# EAGLE design Arduino Talking RepeaterV2.1 (EAGLE 7.4.0)

## Sheet 1 of 2: MAIN Circuit Diagram
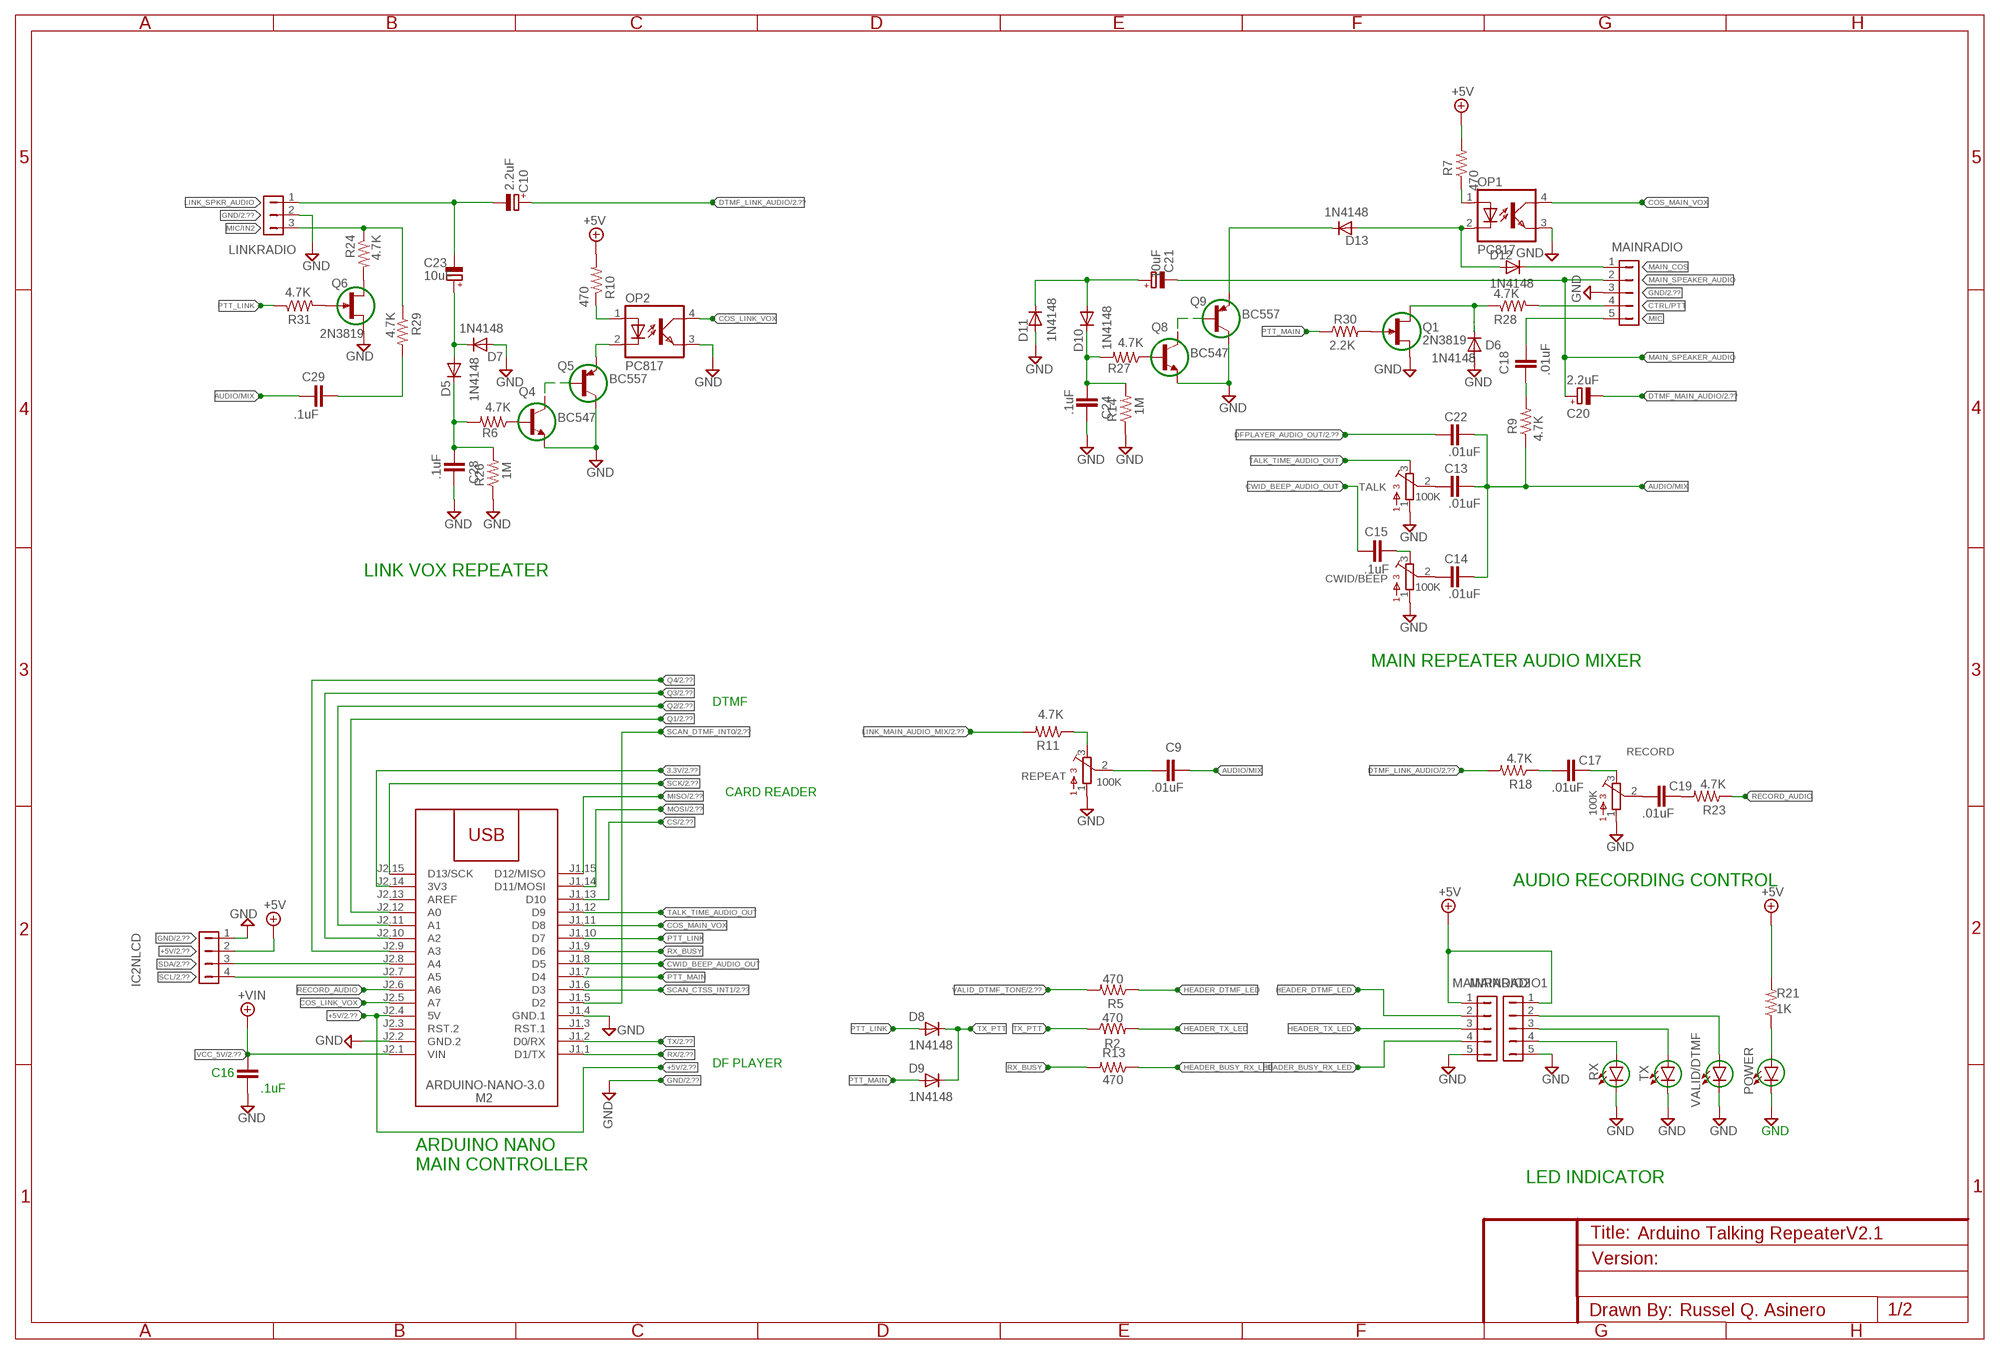
[diagram p0: schematic, sheet 1]

### Parts
C9  .01uF  C5/3  [C5B3]
C10  2.2uF  CPOL-EUE2.5-6  [E2,5-6]
C13  .01uF  C5/3  [C5B3]
C14  .01uF  C5/3  [C5B3]
C15  .1uF  C5/3  [C5B3]
C16  .1uF  C5/3  [C5B3]
C17  .01uF  C5/3  [C5B3]
C18  .01uF  C5/3  [C5B3]
C19  .01uF  C5/3  [C5B3]
C20  2.2uF  CPOL-EUE2.5-6  [E2,5-6]
C21  10uF  CPOL-EUE2.5-6  [E2,5-6]
C22  .01uF  C5/3  [C5B3]
C23  10uF  CPOL-EUE2.5-6  [E2,5-6]
C24  .1uF  C5/3  [C5B3]
C28  .1uF  C5/3  [C5B3]
C29  .1uF  C5/3  [C5B3]
CWID/BEEP  100K  3362P  [3362P]
D5  1N4148  1N4148DO35-10  [DO35-10]
D6  1N4148  1N4148DO35-10  [DO35-10]
D7  1N4148  1N4148DO35-10  [DO35-10]
D8  1N4148  1N4148DO35-10  [DO35-10]
D9  1N4148  1N4148DO35-10  [DO35-10]
D10  1N4148  1N4148DO35-10  [DO35-10]
D11  1N4148  1N4148DO35-10  [DO35-10]
D12  1N4148  1N4148DO35-10  [DO35-10]
D13  1N4148  1N4148DO35-10  [DO35-10]
IC2NLCD  HDR-1X4-70543-?  [70543-04]
LINKRADIO  HDR-1X3-70543-?  [70543-03]
M2  ARDUINO-NANO-3.0  [ARDUINO-NANO-3.0]
MAINRADIO  HDR-1X5-70543-?  [70543-05]
MAINRADIO1  HDR-1X5-70543-?  [70543-05]
MAINRADIO2  HDR-1X5-70543-?  [70543-05]
OP1  PC817  [DIL04]
OP2  PC817  [DIL04]
POWER  LEDB155  [Q62902-B155]
Q1  2N3819  [TO92F]
Q4  BC547  [TO92]
Q5  BC557  [TO92]
Q6  2N3819  [TO92F]
Q8  BC547  [TO92]
Q9  BC557  [TO92]
R2  470  R-US_0207/10  [0207/10]
R5  470  R-US_0207/10  [0207/10]
R6  4.7K  R-US_0207/10  [0207/10]
R7  470  R-US_0207/10  [0207/10]
R9  4.7K  R-US_0207/10  [0207/10]
R10  470  R-US_0207/10  [0207/10]
R11  4.7K  R-US_0207/10  [0207/10]
R13  470  R-US_0207/10  [0207/10]
R14  1M  R-US_0207/10  [0207/10]
R18  4.7K  R-US_0207/10  [0207/10]
R21  1K  R-US_0207/10  [0207/10]
R23  4.7K  R-US_0207/10  [0207/10]
R24  4.7K  R-US_0207/10  [0207/10]
R26  1M  R-US_0207/10  [0207/10]
R27  4.7K  R-US_0207/10  [0207/10]
R28  4.7K  R-US_0207/10  [0207/10]
R29  4.7K  R-US_0207/10  [0207/10]
R30  2.2K  R-US_0207/10  [0207/10]
R31  4.7K  R-US_0207/10  [0207/10]
RECORD  100K  3362P  [3362P]
REPEAT  100K  3362P  [3362P]
RX  LEDB155  [Q62902-B155]
TALK  100K  3362P  [3362P]
TX  LEDB155  [Q62902-B155]
VALID/DTMF  LEDB155  [Q62902-B155]

### Nets
3.3V: M2.J2.14(3V3) ; also sheet 2
+5V: IC2NLCD.2 M2.J2.4(5V) R7.2 R10.2 ; also sheet 2
AUDIO/MIX: C9.1 C13.1 C14.1 C22.1 C29.1 R9.1
BUSY_RX_LED: MAINRADIO2.4 RX.A(ANODE)
COR: D12.A D13.A OP1.2(C)
COR1: OP2.2(C) Q5.1(E)
COS_LINK_VOX: M2.J2.5(A7) OP2.4(COL)
COS_MAIN_VOX: M2.J1.11(D8) OP1.4(COL)
CS: M2.J1.13(D10) ; also sheet 2
CTRL/PTT: MAINRADIO.4 R28.2
CWID_BEEP_AUDIO_OUT: C15.1 M2.J1.8(D5)
DFPLAYER_AUDIO_OUT: C22.2 ; also sheet 2
DTMF_LED: MAINRADIO2.2 VALID/DTMF.A(ANODE)
DTMF_LINK_AUDIO: C10.+ R18.2 ; also sheet 2
DTMF_MAIN_AUDIO: C20.- ; also sheet 2
GND: C16.2 C24.1 C28.1 CWID/BEEP.1 D6.A D7.A D11.A IC2NLCD.1 LINKRADIO.2 M2.J1.4(GND.1) M2.J2.2(GND.2) MAINRADIO1.5 MAINRADIO2.5 MAINRADIO.3 OP1.3(EMIT) OP2.3(EMIT) POWER.K(CATHODE) Q1.S Q4.1(E) Q5.3(C) Q6.S Q8.1(E) Q9.3(C) R14.1 R26.1 RECORD.1 REPEAT.1 RX.K(CATHODE) TALK.1 TX.K(CATHODE) VALID/DTMF.K(CATHODE) ; also sheet 2
HEADER_BUSY_RX_LED: MAINRADIO1.4 R13.1
HEADER_DTMF_LED: MAINRADIO1.2 R5.1
HEADER_TX_LED: MAINRADIO1.3 R2.2
LINK_MAIN_AUDIO_MIX: R11.2 ; also sheet 2
LINK_SPKR_AUDIO: C10.- C23.- LINKRADIO.1
MAIN_COS: D12.C MAINRADIO.1
MAIN_SPEAKER_AUDIO: C20.+ C21.- MAINRADIO.2
MIC: C18.1 MAINRADIO.5
MIC/IN2: LINKRADIO.3 R24.1 R29.1
MISO: M2.J1.15(D12/MISO) ; also sheet 2
MOSI: M2.J1.14(D11/MOSI) ; also sheet 2
N$1: OP2.1(A) R10.1
N$6: Q4.2(B) R6.1
N$9: C15.2 CWID/BEEP.3
N$13: C18.2 R9.2
N$17: C29.2 R29.2
N$18: OP1.1(A) R7.1
N$25: C14.2 CWID/BEEP.2
N$26: R11.1 REPEAT.3
N$27: C9.2 REPEAT.2
N$29: C19.2 RECORD.2
N$30: C17.1 RECORD.3
N$34: C19.1 R23.2
N$38: POWER.A(ANODE) R21.1
N$46: Q8.3(C) Q9.2(B)
N$47: C13.2 TALK.2
N$48: C21.+ D10.A D11.C
N$50: C24.2 D10.C R14.2 R27.2
N$51: Q8.2(B) R27.1
N$54: C17.2 R18.1
N$55: D13.C Q9.1(E)
N$70: Q4.3(C) Q5.2(B)
N$72: Q6.D R24.2
N$73: Q1.G R30.2
N$77: C23.+ D5.A D7.C
N$78: C28.2 D5.C R6.2 R26.2
NA: D6.C Q1.D R28.1
PTT: Q6.G R31.2
PTT_LINK: D8.A M2.J1.10(D7) R31.1
PTT_MAIN: D9.A M2.J1.7(D4) R30.1
Q1: M2.J2.12(A0) ; also sheet 2
Q2: M2.J2.11(A1) ; also sheet 2
Q3: M2.J2.10(A2) ; also sheet 2
Q4: M2.J2.9(A3) ; also sheet 2
RECORD_AUDIO: M2.J2.6(A6) R23.1
RX: M2.J1.1(D1/TX) ; also sheet 2
RX_BUSY: M2.J1.9(D6) R13.2
SCAN_CTSS_INT1: M2.J1.6(D3) ; also sheet 2
SCAN_DTMF_INT0: M2.J1.5(D2) ; also sheet 2
SCK: M2.J2.15(D13/SCK) ; also sheet 2
SCL: IC2NLCD.4 M2.J2.7(A5) ; also sheet 2
SDA: IC2NLCD.3 M2.J2.8(A4) ; also sheet 2
TALK_TIME_AUDIO_OUT: M2.J1.12(D9) TALK.3
TX: M2.J1.2(D0/RX) ; also sheet 2
TX_LED: MAINRADIO2.3 TX.A(ANODE)
TX_PTT: D8.C D9.C R2.1
VALID_DTMF_TONE: R5.2 ; also sheet 2
VCC_5V: C16.1 M2.J2.1(VIN) MAINRADIO1.1 MAINRADIO2.1 R21.2 ; supply symbol labelled +VIN, +5V ; also sheet 2
Unconnected: M2.J1.3(RST.1) M2.J2.3(RST.2) M2.J2.13(AREF)

### Notes on the sheet
- LINK VOX REPEATER
- MAIN REPEATER AUDIO MIXER
- DTMF
- CARD READER
- AUDIO RECORDING CONTROL
- DF PLAYER
- ARDUINO NANO
  MAIN CONTROLLER
- LED INDICATOR

## Sheet 2 of 2: Arduino Modules
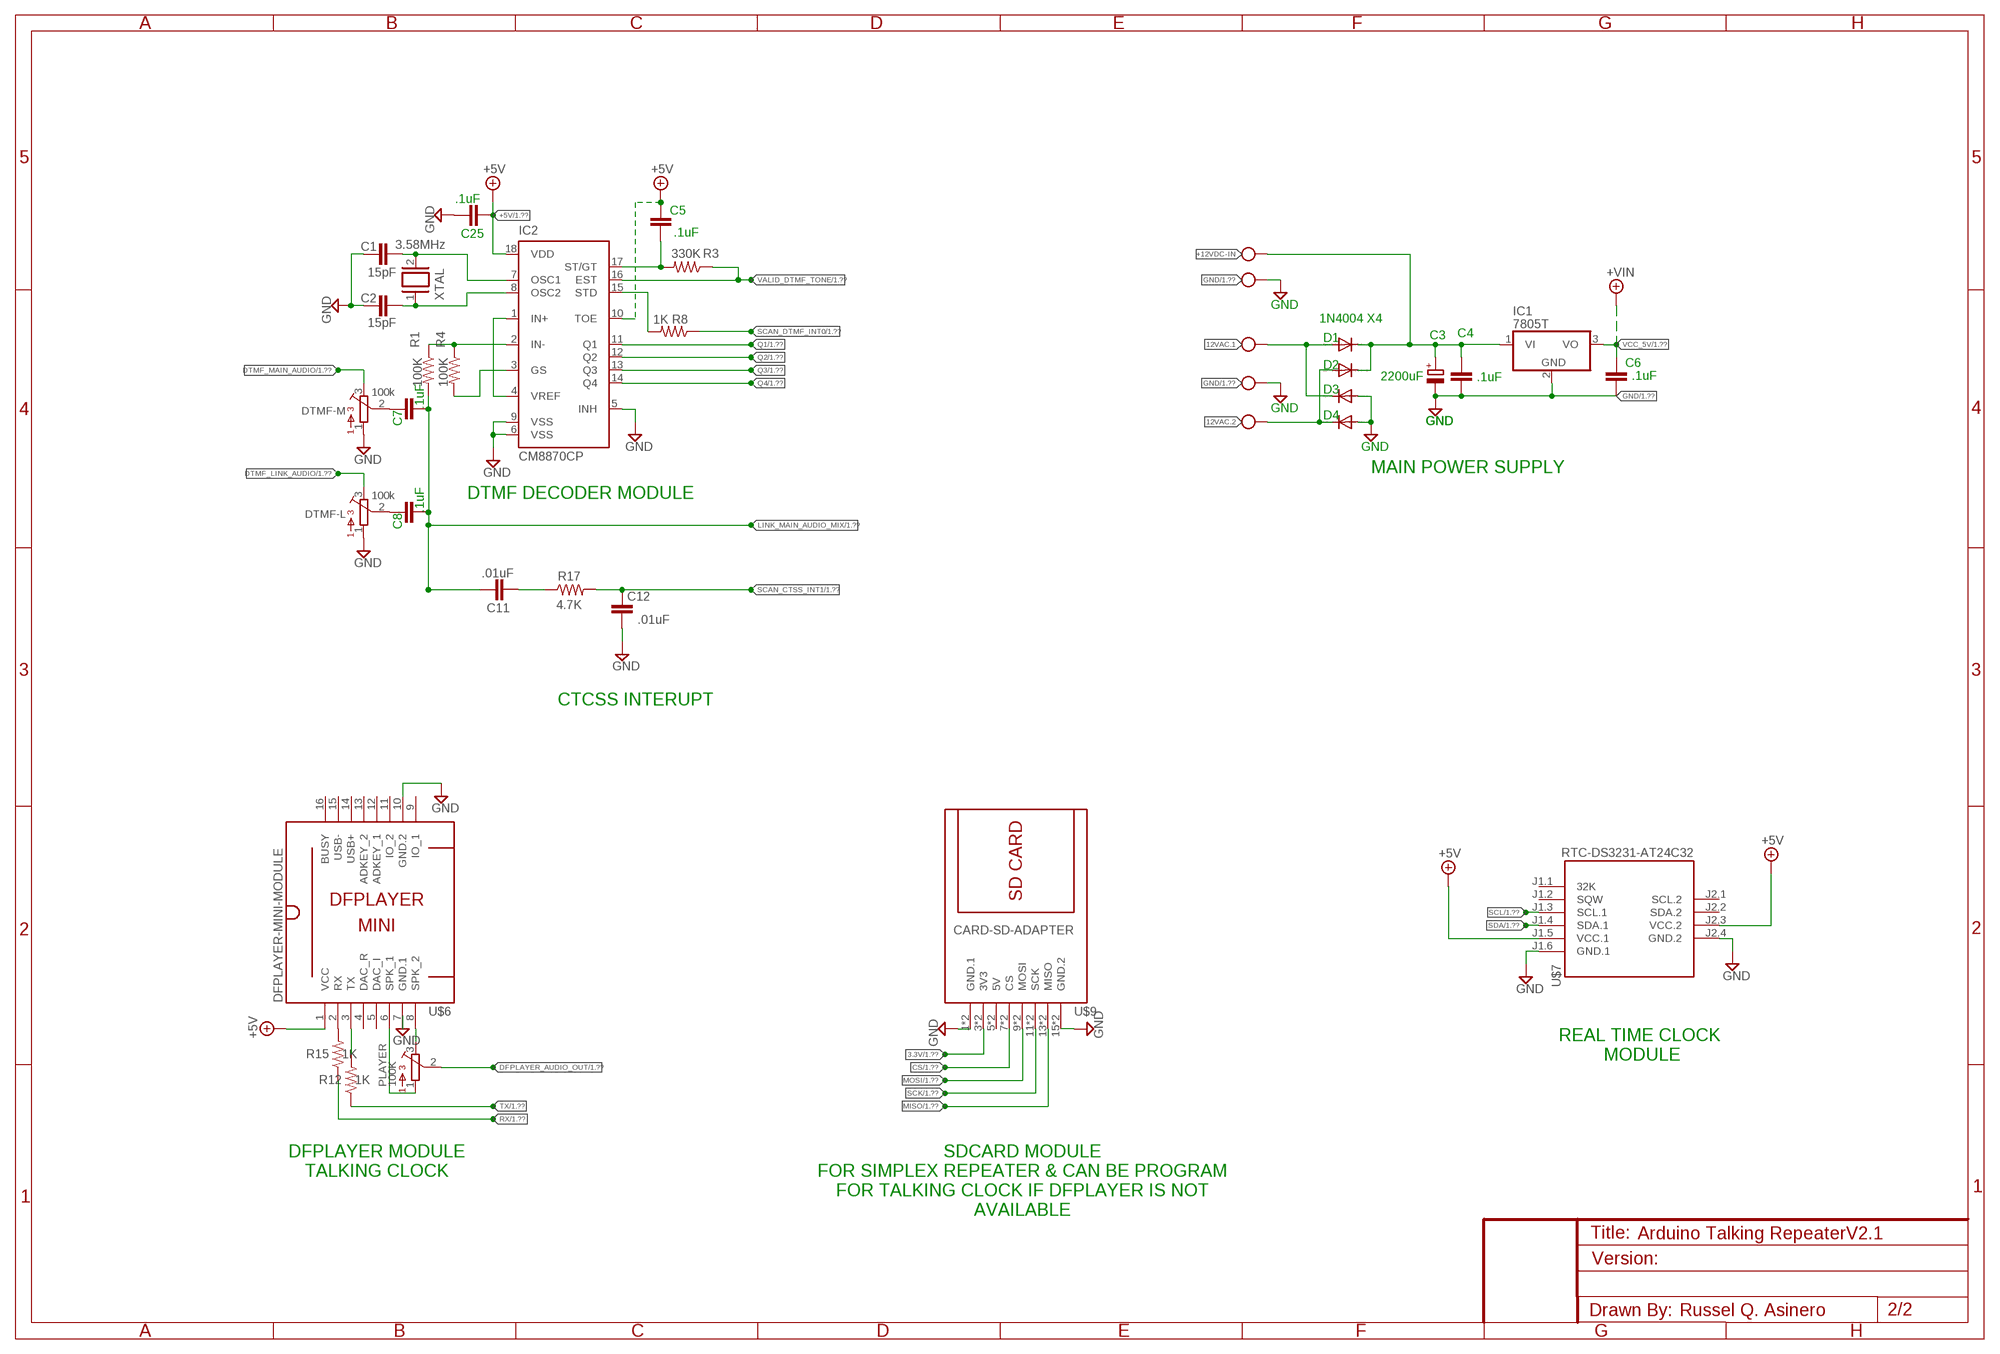
[diagram p1: schematic, sheet 2]

### Parts
12VDC  AK300/2  [AK300/2]
AC  AK500/3  [AK500/3]
C1  15pF  C-EU050-025X075  [C050-025X075]
C2  15pF  C-EU050-025X075  [C050-025X075]
C3  2200uF  CPOL-EUE5-13  [E5-13]
C4  .1uF  C5/3  [C5B3]
C5  .1uF  C5/3  [C5B3]
C6  .1uF  C5/3  [C5B3]
C7  .1uF  C5/3  [C5B3]
C8  .1uF  C5/3  [C5B3]
C11  .01uF  C5/3  [C5B3]
C12  .01uF  C5/3  [C5B3]
C25  .1uF  C5/3  [C5B3]
D1  1N4004  [DO41-10]
D2  1N4004  [DO41-10]
D3  1N4004  [DO41-10]
D4  1N4004 X4  1N4004  [DO41-10]
DTMF-L  100k  3362P  [3362P]
DTMF-M  100k  3362P  [3362P]
IC1  7805T  [TO220H]
IC2  CM8870CP  [DIL18]
PLAYER  100K  3362P  [3362P]
R1  100K  R-US_0207/10  [0207/10]
R3  330K  R-US_0207/10  [0207/10]
R4  100K  R-US_0207/10  [0207/10]
R8  1K  R-US_0207/10  [0207/10]
R12  1K  R-US_0207/10  [0207/10]
R15  1K  R-US_0207/10  [0207/10]
R17  4.7K  R-US_0207/10  [0207/10]
U$6  DFPLAYER-MINI-MODULE  [DFPLAYER-MINI-MODULE]
U$7  RTC-DS3231-AT24C32  [RTC-DS3231-AT24C32]
U$9  CARD-SD-ADAPTER  [CARD-SD-ADAPTER]
XTAL  3.58MHz  XTAL/S  [QS]

### Nets
3.3V: U$9.3(3V3) U$9.4(3V3) ; also sheet 1
12VAC.1: AC.1 D1.A D3.C
12VAC.2: AC.2 D2.A D4.C
+5V: C5.1 C25.2 IC2.10(TOE) IC2.18(VDD) U$6.1(VCC) U$7.J1.5(VCC.1) U$7.J2.3(VCC.2) ; also sheet 1
+12VDC-IN: 12VDC.2 C3.+ C4.1 D1.C D2.C IC1.1(VI)
CLK: C2.2 IC2.8(OSC2) XTAL.1
CS: U$9.7(CS) U$9.8(CS) ; also sheet 1
DFPLAYER_AUDIO_OUT: PLAYER.2 ; also sheet 1
DTMF_LINK_AUDIO: DTMF-L.3 ; also sheet 1
DTMF_MAIN_AUDIO: DTMF-M.3 ; also sheet 1
GND: 12VDC.1 AC.3 C1.1 C2.1 C3.- C4.2 C6.2 C12.2 C25.1 D3.A D4.A DTMF-L.1 DTMF-M.1 IC1.2(GND) IC2.5(INH) IC2.6(VSS) IC2.9(VSS) U$6.7(GND.1) U$6.10(GND.2) U$7.J1.6(GND.1) U$7.J2.4(GND.2) U$9.1(GND.1) U$9.2(GND.1) U$9.15(GND.2) U$9.16(GND.2) ; also sheet 1
LINK_MAIN_AUDIO_MIX: C7.2 C8.2 C11.1 R1.2 ; also sheet 1
MISO: U$9.13(MISO) U$9.14(MISO) ; also sheet 1
MOSI: U$9.9(MOSI) U$9.10(MOSI) ; also sheet 1
N$2: IC2.2(IN-) R1.1 R4.1
N$3: IC2.3(GS) R4.2
N$5: IC2.1(IN+) IC2.4(VREF)
N$10: C1.2 IC2.7(OSC1) XTAL.2
N$14: C5.2 IC2.17(ST/GT) R3.2
N$16: IC2.15(STD) R8.2
N$22: C7.1 DTMF-M.2
N$31: C8.1 DTMF-L.2
N$45: C11.2 R17.1
N$52: R12.2 U$6.3(TX)
N$53: R15.2 U$6.2(RX)
N$58: PLAYER.3 U$6.8(SPK_2)
N$60: PLAYER.1 U$6.6(SPK_1)
Q1: IC2.11(Q1) ; also sheet 1
Q2: IC2.12(Q2) ; also sheet 1
Q3: IC2.13(Q3) ; also sheet 1
Q4: IC2.14(Q4) ; also sheet 1
RX: R15.1 ; also sheet 1
SCAN_CTSS_INT1: C12.1 R17.2 ; also sheet 1
SCAN_DTMF_INT0: R8.1 ; also sheet 1
SCK: U$9.11(SCK) U$9.12(SCK) ; also sheet 1
SCL: U$7.J1.3(SCL.1) ; also sheet 1
SDA: U$7.J1.4(SDA.1) ; also sheet 1
TX: R12.1 ; also sheet 1
VALID_DTMF_TONE: IC2.16(EST) R3.1 ; also sheet 1
VCC_5V: C6.1 IC1.3(VO) ; supply symbol labelled +VIN ; also sheet 1
Unconnected: U$6.4(DAC_R) U$6.5(DAC_I) U$6.9(IO_1) U$6.11(IO_2) U$6.12(ADKEY_1) U$6.13(ADKEY_2) U$6.14(USB+) U$6.15(USB-) U$6.16(BUSY) U$7.J1.1(32K) U$7.J1.2(SQW) U$7.J2.1(SCL.2) U$7.J2.2(SDA.2)

### Notes on the sheet
- MAIN POWER SUPPLY
- DTMF DECODER MODULE
- CTCSS INTERUPT
- REAL TIME CLOCK 
  MODULE
- DFPLAYER MODULE
  TALKING CLOCK
- SDCARD MODULE
  FOR SIMPLEX REPEATER & CAN BE PROGRAM
  FOR TALKING CLOCK IF DFPLAYER IS NOT
  AVAILABLE

## Power pins joined to a net without a drawn wire
5V: U$9.5(5V) U$9.6(5V)

## Library data of the parts
12VDC = con-ptr500:AK300/2: CONNECTOR; OC_FARNELL: unknown; OC_NEWARK: unknown
AC = con-ptr500:AK500/3: CONNECTOR; OC_FARNELL: unknown; OC_NEWARK: unknown
C1 C2 = rcl:C-EU: CAPACITOR, European symbol
C3 = rcl:CPOL-EU: POLARIZED CAPACITOR, European symbol
C4-C9 C11-C19 C22 C24 C25 C28 C29 = capacitor-wima:C: CAPACITOR naming: grid - package width
C10 C20 C21 C23 = qfm-trx1-24g:CPOL-EU: POLARIZED CAPACITOR, European symbol
CWID/BEEP DTMF-L DTMF-M PLAYER RECORD REPEAT TALK = bourns:3362: 3362 Series 1/4" Square Trimmer
D1-D4 = diode:1N4004: DIODE general purpose rectifier, 1 A
D5 D7-D13 = Arduino Talking RepeaterV1.9 lm358:1N4148: DIODE high speed (Philips)
D6 = diode:1N4148: DIODE high speed (Philips)
IC1 = adafruit:78*: Positive VOLTAGE REGULATOR Added bigger pads to the TO-92 package
IC2 = california-micro-devices:CM8870C: CMOS Integrated DTMF Receiver cm8870.pdf; OC_FARNELL: unknown; OC_NEWARK: unknown
IC2NLCD = con-hdrs40:HDR-1X4: HEADER CONNECTOR
LINKRADIO = con-hdrs40:HDR-1X3: HEADER CONNECTOR
M2 = Arduino Talking RepeaterV1.9 lm358:ARDUINO-NANO-3.0: Arduino Nano 3.0 and compatible devices More details available here: https://www.arduino.cc/en/Main/ArduinoBoardNano Click here to find device on ebay.com <http://www.ebay.com/sch/arduino+nano>
MAINRADIO MAINRADIO1 MAINRADIO2 = con-hdrs40:HDR-1X5: HEADER CONNECTOR
OP1 OP2 = optocoupler:PC817: SHARP OPTO COUPLER; MPN: PC817X4J000F; OC_FARNELL: 9707727; OC_NEWARK: 97K7059
POWER RX TX VALID/DTMF = tango:LED: LED OSRAM: - CHIPLED LG R971, LG N971, LY N971, LG Q971, LY Q971, LO R971, LY R971 LH N974, LH R974 LS Q976, LO Q976, LY Q976 LO Q996 - Hyper CHIPLED LW Q18S LB Q993, LB Q99A, LB R99A - SideLED LS A670, LO A670, LY A670, LG A670, LP A670 LB A673, LV A673, LT A673, LW A673 LH A674 LY A675 LS A676, LA A676, LO A676, LY A676, LW A676 LS A679, LY A679, LG A679 - Hyper Micro SIDELED® LS Y876, LA Y876, LO Y876, LY Y876 LT Y87S - SmartLED LW L88C, LW L88S LB L89C, LB L89S, LG L890 LS L89K, LO L89K, LY L89K LS L896, LA L896, LO L896, LY L896 - TOPLED LS T670, LO T670, LY T670, LG T670, LP T670 LSG T670, LSP T670, LSY T670, LOP T670, LYG T670 LG T671, LOG T671, LSG T671 LB T673, LV T673, LT T673, LW T673 LH T674 LS T676, LA T676, LO T676, LY T676, LB T676, LH T676, LSB T676, LW T676 LB T67C, LV T67C, LT T67C, LS T67K, LO T67K, LY T67K, LW E67C LS E67B, LA E67B, LO E67B, LY E67B, LB E67C, LV E67C, LT E67C LW T67C LS T679, LY T679, LG T679 LS T770, LO T770, LY T770, LG T770, LP T770 LB T773, LV T773, LT T773, LW T773 LH T774 LS E675, LA E675, LY E675, LS T675 LS T776, LA T776, LO T776, LY T776, LB T776 LHGB T686 LT T68C, LB T68C - Hyper Mini TOPLED® LB M676 - Mini TOPLED Santana® LG M470 LS M47K, LO M47K, LY M47K Source: http://www.osram.convergy.de - LUMILED® LXK2-PW12-R00, LXK2-PW12-S00, LXK2-PW14-U00, LXK2-PW14-V00 LXK2-PM12-R00, LXK2-PM12-S00, LXK2-PM14-U00 LXK2-PE12-Q00, LXK2-PE12-R00, LXK2-PE12-S00, LXK2-PE14-T00, LXK2-PE14-U00 LXK2-PB12-K00, LXK2-PB12-L00, LXK2-PB12-M00, LXK2-PB14-N00, LXK2-PB14-P00, LXK2-PB14-Q00 LXK2-PR12-L00, LXK2-PR12-M00, LXK2-PR14-Q00, LXK2-PR14-R00 LXK2-PD12-Q00, LXK2-PD12-R00, LXK2-PD12-S00 LXK2-PH12-R00, LXK2-PH12-S00 LXK2-PL12-P00, LXK2-PL12-Q00, LXK2-PL12-R00 Source: www.luxeon.com
Q1 Q6 = transistor-small-signal:2N3819: N-CHANNEL FET
Q4 Q8 = transistor:BC547: NPN TRANSISTOR
Q5 Q9 = transistor-pnp:BC557: PNP Transistor
R1-R15 R17 R18 R21 R23 R24 R26-R31 = resistor:R-US_: RESISTOR, American symbol
U$6 = diy-modules:DFPLAYER-MINI-MODULE: DFPlayer Mini - MP3 player module based on YX5200 chip More details available here: https://www.dfrobot.com/wiki/index.php/DFPlayer_Mini_SKU:DFR0299 Click here to find device on ebay.com <http://www.ebay.com/sch/dfplayer+mini>
U$7 = diy-modules:RTC-DS3231-AT24C32: RTC Module with Battery and EEPROM based on DS3231 and AT24C32 chips Tutorial can be found here: https://edwardmallon.wordpress.com/2014/05/21/using-a-cheap-3-ds3231-rtc-at24c32-eeprom-from-ebay/ Click here to find device on ebay.com <http://www.ebay.com/sch/DS3231+AT24C32+module>
U$9 = diy-modules:CARD-SD-ADAPTER: Full Size SD Card Adapter Module with onboard 3.3V regulator Guide describing how to use SD card with Arduino is available here: https://www.arduino.cc/en/Reference/SDCardNotes Click here to find device on ebay.com <http://www.ebay.com/sch/sd+card+socket+module>
XTAL = special:XTAL/S: CRYSTAL

## Board
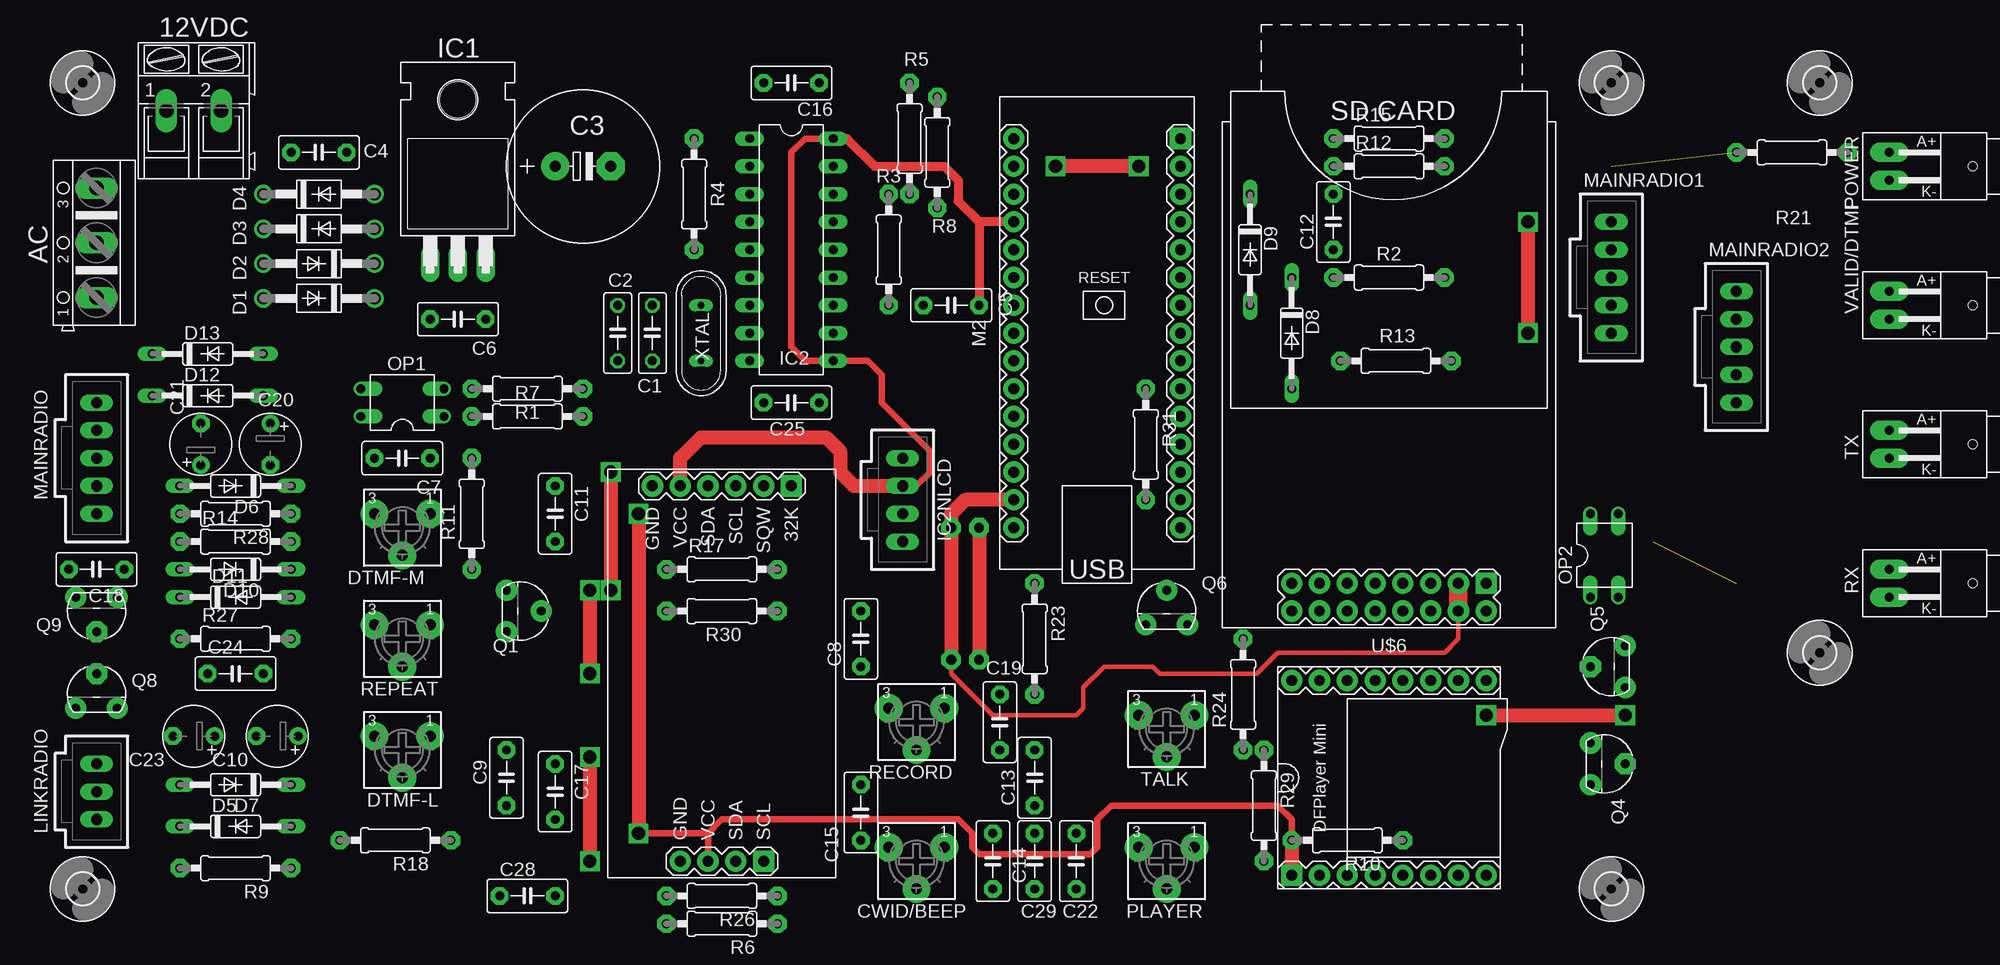
[diagram p2: board, top side]
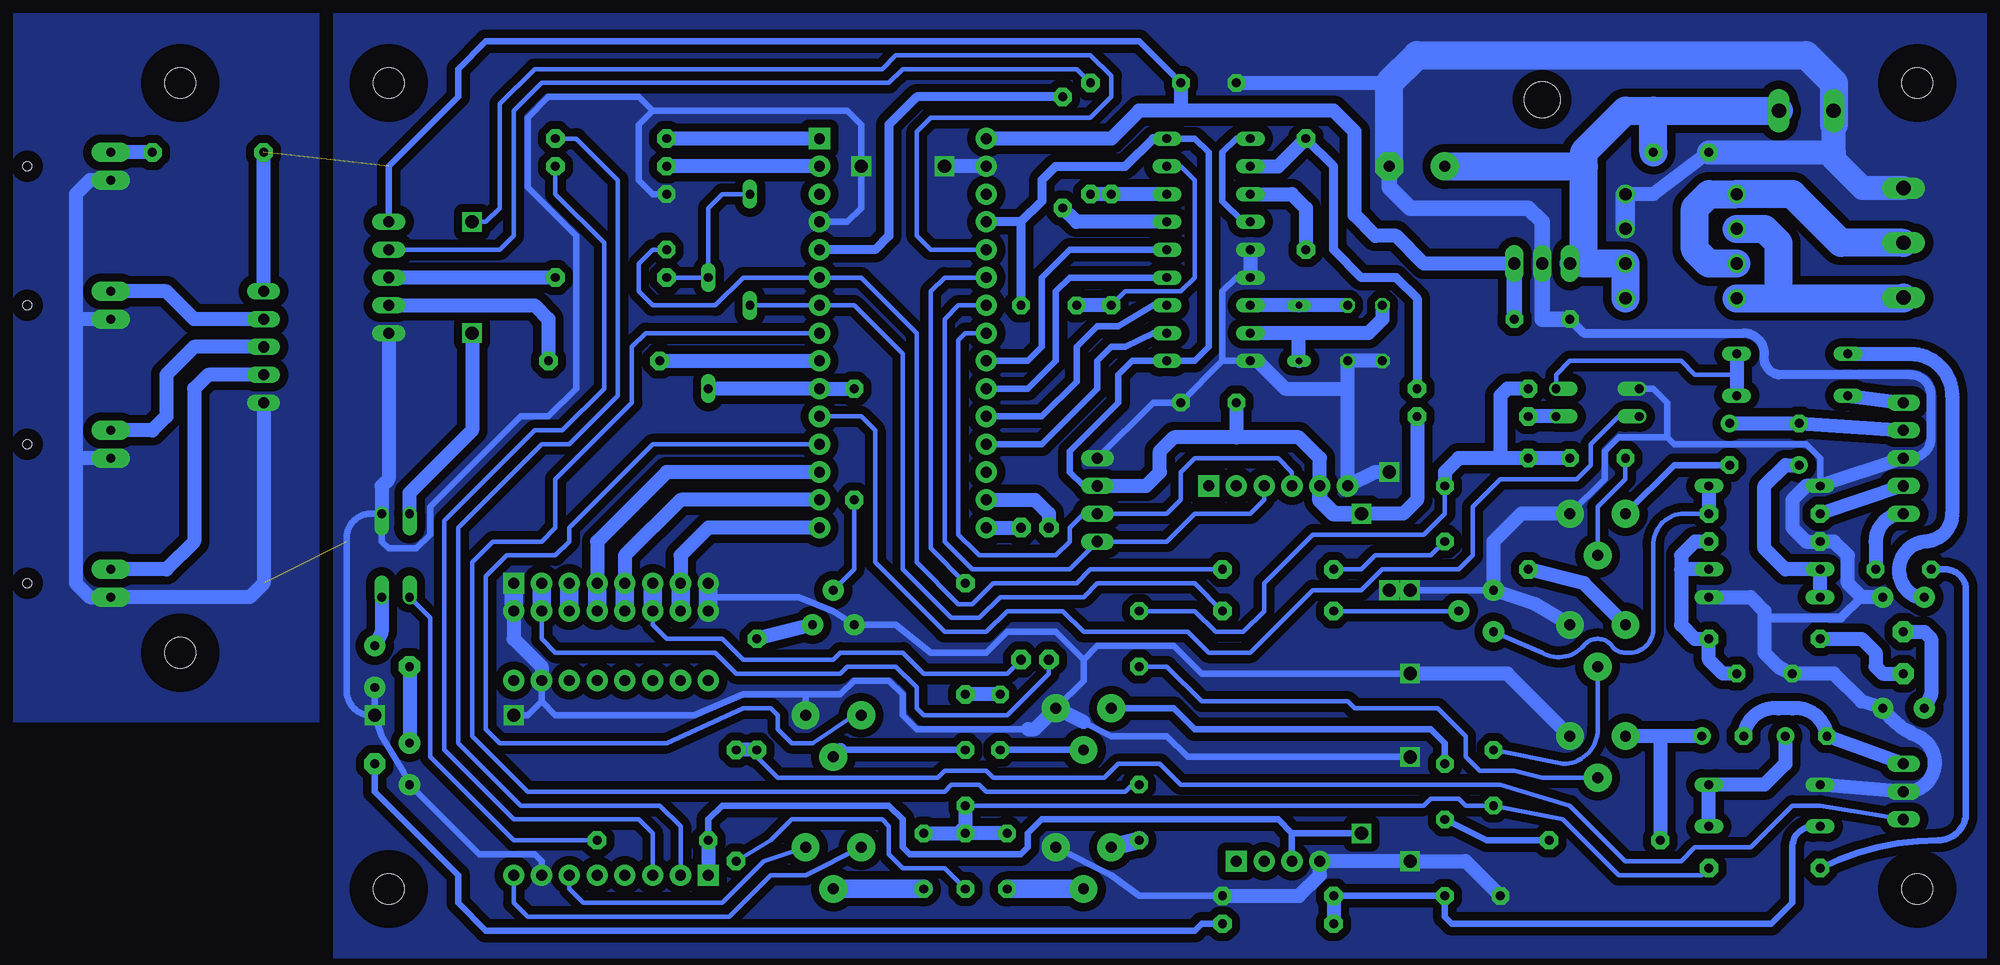
[diagram p3: board, bottom side, seen from below]

No outline drawn. Coordinates in mm, seen from the top.
Copper layers (1*16): Top 0.035mm / dielectric 1.5mm / Bottom 0.035mm
Design rules "default *": minimum track width 10mil, minimum drill 24mil, track to track 30mil, track to pad 35mil, pad to pad 8mil, via to via 8mil, smd to smd 8mil, copper to edge 40mil, drill to drill 8mil, minimum pad ring 10mil, minimum via ring 8mil, stop-mask expansion 4mil, vias tented up to drill 0mil, thermal gap 0mil

### Footprints (pad centres in the part's own frame; a part is rotated, then mirrored left to right if it is on the bottom)
AK300/2 = drill 1.321 long: 1 -2.515,0; 2 2.489,0
AK500/3 = drill 1.321 long: 1 -5.004,0; 2 0,0; 3 5.004,0
C050-025X075 = drill 0.813 octagon: 1 -2.54,0; 2 2.54,0
E5-13 = drill 1.016 pad 2.54: + -2.54,0 | drill 1.016 pad 2.54 octagon: - 2.54,0
C5B3 = drill 0.813 pad 1.6 octagon: 1 -2.54,0; 2 2.54,0
E2,5-6 = drill 0.813 pad 1.6: + -1.905,0 | drill 0.813 pad 1.6 octagon: - 1.905,0
3362P = drill 1 pad 2.54: 1 -2.54,-1.27; 2 0,2.54; 3 2.54,-1.27
DO41-10 = drill 1.118: A 5.08,0; C -5.08,0
DO35-10 = drill 0.813 long: A 5.08,0; C -5.08,0
TO220H = drill 1.118 long: 1 -2.54,-10.16; 2 0,-10.16; 3 2.54,-10.16 | hole 3.302: 0,4.826
DIL18 = drill 0.813 long: 1 -10.16,-3.81; 2 -7.62,-3.81; 3 -5.08,-3.81; 4 -2.54,-3.81; 5 0,-3.81; 6 2.54,-3.81; 7 5.08,-3.81; 8 7.62,-3.81; 9 10.16,-3.81; 10 10.16,3.81; 11 7.62,3.81; 12 5.08,3.81; 13 2.54,3.81; 14 0,3.81; 15 -2.54,3.81; 16 -5.08,3.81; 17 -7.62,3.81; 18 -10.16,3.81
70543-04 = drill 1.016 long: 1 -3.81,0; 2 -1.27,0; 3 1.27,0; 4 3.81,0
70543-03 = drill 1.016 long: 1 -2.54,0; 2 0,0; 3 2.54,0
ARDUINO-NANO-3.0 = drill 1 pad 1.93 square: J1.1 17.78,-7.62 | drill 1 pad 1.93: J1.2 15.24,-7.62; J1.3 12.7,-7.62; J1.4 10.16,-7.62; J1.5 7.62,-7.62; J1.6 5.08,-7.62; J1.7 2.54,-7.62; J1.8 0,-7.62; J1.9 -2.54,-7.62; J1.10 -5.08,-7.62; J1.11 -7.62,-7.62; J1.12 -10.16,-7.62; J1.13 -12.7,-7.62; J1.14 -15.24,-7.62; J1.15 -17.78,-7.62; J2.1 17.78,7.62; J2.2 15.24,7.62; J2.3 12.7,7.62; J2.4 10.16,7.62; J2.5 7.62,7.62; J2.6 5.08,7.62; J2.7 2.54,7.62; J2.8 0,7.62; J2.9 -2.54,7.62; J2.10 -5.08,7.62; J2.11 -7.62,7.62; J2.12 -10.16,7.62; J2.13 -12.7,7.62; J2.14 -15.24,7.62; J2.15 -17.78,7.62
70543-05 = drill 1.016 long: 1 -5.08,0; 2 -2.54,0; 3 0,0; 4 2.54,0; 5 5.08,0
DIL04 = drill 0.813 offset: 1 -1.27,-3.81; 2 1.27,-3.81; 3 1.27,3.81; 4 -1.27,3.81
Q62902-B155 = drill 0.813 pad 1.778 long: A 7.62,-1.27; K 7.62,1.27 | hole 0.813: 0,0
TO92F = drill 0.813 pad 1.93: D 1.905,-1.27; G 0,1.905; S -1.905,-1.27
TO92 = drill 0.813 pad 1.93: 1 1.905,-1.27; 3 -1.905,-1.27 | drill 0.813 pad 1.93 octagon: 2 0,1.905
0207/10 = drill 0.813 pad 1.676 octagon: 1 -5.08,0; 2 5.08,0
2,8 = hole 2.8: 0,0
DFPLAYER-MINI-MODULE = drill 1 pad 1.93 square: 1 -8.89,-8.89 | drill 1 pad 1.93: 2 -6.35,-8.89; 3 -3.81,-8.89; 4 -1.27,-8.89; 5 1.27,-8.89; 6 3.81,-8.89; 7 6.35,-8.89; 8 8.89,-8.89; 9 8.89,8.89; 10 6.35,8.89; 11 3.81,8.89; 12 1.27,8.89; 13 -1.27,8.89; 14 -3.81,8.89; 15 -6.35,8.89; 16 -8.89,8.89
RTC-DS3231-AT24C32 = drill 1 pad 1.93 square: J1.1 -17.78,6.35; J2.1 16.51,3.81 | drill 1 pad 1.93: J1.2 -17.78,3.81; J1.3 -17.78,1.27; J1.4 -17.78,-1.27; J1.5 -17.78,-3.81; J1.6 -17.78,-6.35; J2.2 16.51,1.27; J2.3 16.51,-1.27; J2.4 16.51,-3.81
CARD-SD-ADAPTER = drill 1 pad 1.93 square: 1 -19.05,-8.89 | drill 1 pad 1.93: 2 -21.59,-8.89; 3 -19.05,-6.35; 4 -21.59,-6.35; 5 -19.05,-3.81; 6 -21.59,-3.81; 7 -19.05,-1.27; 8 -21.59,-1.27; 9 -19.05,1.27; 10 -21.59,1.27; 11 -19.05,3.81; 12 -21.59,3.81; 13 -19.05,6.35; 14 -21.59,6.35; 15 -19.05,8.89; 16 -21.59,8.89
QS = drill 0.61 long: 1 -2.54,0; 2 2.54,0

### Placement (x,y rotation side)
12VDC  19.05,77.47 0 top
AC  10.16,65.41 90 top
C1  60.96,57.15 90 top
C2  57.78,57.15 90 top
C3  54.61,72.39 0 top
C4  30.48,73.66 180 top
C5  88.27,59.69 180 top
C6  43.18,58.42 180 top
C7  38.1,45.72 0 top
C8  80.01,29.21 90 top
C9  47.62,16.51 90 top
C10  26.67,20.32 180 top
C11  52.07,40.64 270 top
C12  123.19,67.31 90 top
C13  95.89,16.51 90 top
C14  92.08,8.89 270 top
C15  80.01,13.34 270 top
C16  73.66,80.01 180 top
C17  52.07,15.24 270 top
C18  10.16,35.56 180 top
C19  92.71,21.59 270 top
C20  26.04,46.99 270 top
C21  19.68,46.99 90 top
C22  99.69,8.89 270 top
C23  19.05,20.32 180 top
C24  22.86,26.04 0 top
C25  73.66,50.8 180 top
C28  49.53,5.71 0 top
C29  95.89,8.89 270 top
CWID/BEEP  85.09,8.89 180 top
D1  30.48,60.33 180 top
D2  30.48,63.5 180 top
D3  30.48,66.67 0 top
D4  30.48,69.85 0 top
D5  22.86,12.06 0 top
D6  22.86,43.18 180 top
D7  22.86,15.88 180 top
D8  119.38,57.15 270 top
D9  115.57,64.77 270 top
D10  22.86,35.56 180 top
D11  22.86,33.02 0 top
D12  20.32,51.44 0 top
D13  20.32,55.24 0 top
DTMF-L  38.1,19.05 180 top
DTMF-M  38.1,39.37 180 top
IC1  43.18,73.66 0 top
IC2  73.66,64.77 270 top
IC2NLCD  83.82,41.91 270 top
LINKRADIO  10.16,15.24 270 top
M2  101.6,57.15 90 top
MAINRADIO  10.16,45.72 270 top
MAINRADIO1  148.59,62.23 270 top
MAINRADIO2  160.02,55.88 270 top
OP1  38.1,50.8 90 top
OP2  147.96,36.83 0 top
PLAYER  107.95,8.89 180 top
POWER  181.61,72.39 180 top
Q1  48.9,31.75 270 top
Q4  147.96,17.78 270 top
Q5  148.59,26.67 90 top
Q6  107.95,31.75 0 top
Q8  10.16,24.13 0 top
Q9  10.16,31.75 180 top
R1  49.53,52.07 180 top
R2  128.27,62.23 0 top
R3  82.55,64.77 270 top
R4  64.77,69.85 270 top
R5  84.45,74.93 270 top
R6  67.31,3.17 180 top
R7  49.53,49.53 0 top
R8  87,73.66 270 top
R9  22.86,8.26 180 top
R10  124.46,10.79 180 top
R11  44.45,40.64 90 top
R12  128.27,72.39 0 top
R13  128.91,54.61 180 top
R14  22.86,38.1 0 top
R15  128.27,74.93 0 top
R17  67.31,35.56 0 top
R18  37.47,10.79 180 top
R21  165.1,73.66 180 top
R23  95.89,29.21 270 top
R24  114.94,24.13 90 top
R26  67.31,5.71 180 top
R27  22.86,29.21 0 top
R28  22.86,40.64 180 top
R29  116.84,13.97 270 top
R30  67.31,31.75 180 top
R31  106.05,46.99 270 top
RECORD  85.09,21.59 180 top
REPEAT  38.1,29.21 180 top
RX  181.61,34.29 180 top
TALK  107.95,20.95 180 top
TX  181.61,46.99 180 top
U$1  [2,8]  8.89,80.01 90 top
U$2  [2,8]  8.89,6.35 90 top
U$3  [2,8]  148.59,80.01 90 top
U$4  [2,8]  148.59,6.35 90 top
U$5  [2,8]  167.64,80.01 90 top
U$6  128.27,16.51 0 top
U$7  67.31,25.4 270 top
U$8  [2,8]  167.64,27.94 90 top
U$9  128.27,53.34 90 top
VALID/DTMF  181.61,59.69 180 top
XTAL  65.41,57.15 90 top

### Tracks (layer width: path | path; a pad name or v marks a point on that pad's centre or on a via)
3.3V  (via drill 0.9 pad 1.78)
  Top 0.406: U$9.4 134.62,29.21 133.35,27.94 118.11,27.94 116.2,26.04 107.31,26.04 106.68,26.67 102.23,26.67 100.33,24.77 100.33,22.86 99.69,22.23 92.08,22.23 88.27,26.04 v88.27,27.3
  Top 1.27: v88.27,27.3 v88.27,39.37 88.27,40.64 89.53,41.91 M2.J2.14
  Top 1.676: U$9.4 U$9.3
  Bottom 0.406: U$9.3 134.62,29.21 133.35,27.94 118.75,27.94 116.84,26.04 107.31,26.04 106.68,26.67 102.23,26.67 100.33,24.77 100.33,22.86 99.69,22.23 92.08,22.23 88.27,26.04 v88.27,27.3
  Bottom 1.27: M2.J2.14 89.53,41.91 88.27,40.64 v88.27,39.37
  Bottom 1.676: U$9.3 U$9.4
5V
  Bottom 1.676: U$9.5 U$9.6
12VAC.1
  Bottom 2.54: D3.C 22.86,66.67 21.59,65.41 21.59,60.33 | D1.A 21.59,60.33 | 21.59,60.33 10.16,60.33 AC.1
12VAC.2
  Bottom 2.54: D2.A 27.94,63.5 29.21,64.77 29.21,68.58 27.94,69.85 D4.C 20.32,69.85 15.88,65.41 AC.2
+5V  (via drill 1.2)
  Top 0.61: IC2NLCD.2 85.09,43.18 86.36,44.45 86.36,46.35 81.92,50.8 81.92,53.34 80.64,54.61 IC2.10 74.93,54.61 73.66,55.88 73.66,73.66 74.93,74.93 IC2.18 | 66.04,11.43 67.31,12.7 88.9,12.7 90.17,11.43 90.17,10.16 90.81,9.53 100.97,9.53 101.6,10.16 101.6,12.7 102.87,13.97 118.11,13.97 119.38,12.7 R10.2 | v59.69,11.43 66.04,11.43 | 66.04,11.43 U$7.J2.3
  Top 0.813: IC2.18 78.74,74.93 81.28,72.39 87.63,72.39 88.9,71.12 88.9,69.22 90.81,67.31 | 90.81,67.31 C5.1 | M2.J2.4 90.81,67.31
  Top 1.27: R10.2 U$6.1 | v59.69,40.64 v59.69,11.43 | U$7.J1.5 63.5,45.72 65.41,47.62 76.83,47.62 78.11,46.35 78.11,44.45 79.38,43.18 IC2NLCD.2
  Bottom 0.61: IC2.18 74.93,74.93 73.66,73.66 73.66,55.88 74.93,54.61 IC2.10 80.64,54.61 81.92,53.34 81.92,50.8 86.36,46.35 86.36,44.45 85.09,43.18 IC2NLCD.2 | R10.2 119.38,12.7 118.11,13.97 102.87,13.97 101.6,12.7 101.6,10.16 100.97,9.53 90.81,9.53 90.17,10.16 90.17,11.43 88.9,12.7 67.31,12.7 66.04,11.43 | U$7.J2.3 66.04,11.43 | v59.69,11.43 66.04,11.43
  Bottom 0.813: 90.81,67.31 88.9,69.22 88.9,71.12 87.63,72.39 81.28,72.39 78.74,74.93 IC2.18 | 90.81,67.31 M2.J2.4 | 90.81,67.31 C5.1
  Bottom 1.27: U$7.J1.5 63.5,45.72 65.41,47.62 71.12,47.62 | 71.12,47.62 76.83,47.62 78.11,46.35 78.11,44.45 79.38,43.18 IC2NLCD.2 | C25.2 71.12,47.62 | R10.2 U$6.1 | R7.2 54.61,41.91 55.88,40.64 v59.69,40.64
  Bottom 1.422: v59.69,40.64 62.23,40.64 63.5,41.91 U$7.J1.5
+12VDC-IN
  Bottom 1.93: IC1.1 39.37,63.5
  Bottom 2.54: D1.C D2.C 39.37,63.5 39.37,72.39 | 39.37,72.39 39.37,73.66 35.56,77.47 33.02,77.47 | 33.02,77.47 12VDC.2 | C4.1 33.02,77.47 | C3.+ 39.37,72.39
AUDIO/MIX
  Bottom 0.406: C13.1 53.98,13.97 53.34,14.61 50.8,14.61 50.16,13.97 C9.1 41.27,12.7 36.2,7.62 28.57,7.62 R9.1
  Bottom 1.27: C22.1 96.52,11.43 | 96.52,11.43 C29.1 C14.1 | C13.1 95.89,12.06 96.52,11.43
BUSY_RX_LED
  Bottom 1.27: MAINRADIO2.4 165.1,53.34 166.37,52.07 166.37,38.1 168.91,35.56 RX.A
CLK
  Bottom 1.27: C2.2 57.78,58.42 59.05,57.15 65.41,57.15 | 65.41,57.15 IC2.8 | XTAL.1 65.41,57.15
COR
  Bottom 0.406: OP1.2 41.91,53.34 40.64,54.61 30.48,54.61 29.21,53.34 25.4,53.34
  Bottom 1.27: D13.A 25.4,53.34 D12.A
COR1
  Bottom 1.27: OP2.2 149.22,29.84 Q5.1
COS_LINK_VOX  (via drill 1.2)
  Top 1.27: v140.97,67.31 v140.97,57.15
  Bottom 0.406: M2.J2.5 99.06,64.77 100.33,66.04 100.33,75.56 99.06,76.83 84.45,76.83 82.55,78.74 82.55,80.64 84.45,82.55 102.23,82.55 103.5,81.28 135.25,81.28 138.43,78.11 138.43,68.58 139.7,67.31 v140.97,67.31
  Bottom 1.27: OP2.4 146.69,42.55 140.97,48.26 v140.97,57.15
COS_MAIN_VOX
  Bottom 0.406: M2.J1.11 105.41,49.53 104.14,48.26 104.14,36.2 97.79,29.84 93.98,29.84 92.08,31.75 87,31.75 85.09,29.84 75.56,29.84 73.66,27.94 69.85,27.94 64.14,33.66 59.69,33.66 57.78,35.56 50.8,35.56 49.53,36.83 49.53,41.27 46.99,43.81 40.01,43.81 38.73,45.09 38.73,46.99 36.2,49.53 OP1.4
CS
  Bottom 1.27: M2.J1.13 123.19,44.45 129.54,38.1 U$9.7
  Bottom 1.676: U$9.7 U$9.8
CTRL/PTT
  Bottom 1.27: MAINRADIO.4 R28.2
CWID_BEEP_AUDIO_OUT
  Bottom 0.406: C15.1 80.64,15.88 81.28,15.24 93.98,15.24 94.61,15.88 97.16,15.88 97.79,15.24 135.89,15.24 140.97,20.32 140.97,36.2 139.06,38.1 134.62,38.1 133.35,39.37 133.35,43.81 126.36,50.8 126.36,55.88 125.09,57.15 M2.J1.8
DFPLAYER_AUDIO_OUT
  Bottom 1.676: C22.2 PLAYER.2
DTMF_LED
  Bottom 1.27: MAINRADIO2.2 166.37,58.42 168.91,60.96 VALID/DTMF.A
DTMF_LINK_AUDIO
  Bottom 1.27: C10.+ 32.38,20.32 | 32.38,20.32 DTMF-L.3 | 32.38,20.32 R18.2
DTMF_MAIN_AUDIO
  Bottom 0.61: C20.- 31.11,45.09 DTMF-M.3
GND  (via drill 1.2)  (1 unrouted)
  Top 1.27: v55.24,33.66 v55.24,26.04 | v57.15,44.45 v57.15,33.66 | v137.16,22.23 v149.86,22.23 | v105.41,72.39 v97.79,72.39 | v55.24,18.41 v55.24,8.89
  Bottom 0.61: IC2.6 71.12,62.23 72.39,60.96 72.39,54.61 | 72.39,54.61 C25.1 78.74,50.8 IC2NLCD.1 | 72.39,54.61 IC2.9 | U$6.7 134.62,8.89 135.25,9.53 140.34,9.53 Q4.1 147.32,17.14 149.22,20.32 v149.86,22.23 | U$6.10 134.62,23.5 | 134.62,23.5 133.35,22.23 120.65,22.23 116.2,24.13 110.49,24.13 | 110.49,24.13 107.31,24.13 106.05,25.4 102.87,25.4 101.6,24.13 101.6,22.23 100.33,20.95 90.17,20.95 | M2.J1.4 106.68,67.31 105.41,68.58 v105.41,72.39 105.41,76.2 106.68,77.47 124.46,77.47 | 124.46,77.47 125.73,76.2 125.73,71.12 124.46,69.85 C12.2 | 124.46,77.47 125.73,78.74 133.99,78.74 135.89,76.83 135.89,70.48 131.44,66.04 131.44,52.07 133.99,49.53 136.53,49.53 144.78,41.27 144.78,38.73 146.05,37.47 148.59,37.47 149.22,38.1 OP2.3 150.5,40.64 arc-90 152.4,38.1 152.4,24.13 arc-90 v149.86,22.23 | v137.16,22.23 135.89,22.23 134.62,23.5 | Q5.3 v149.86,22.23 | TALK.1 110.49,24.13 | v55.24,33.66 Q1.S | 85.09,27.3 87.63,29.84 92.08,29.84 93.98,27.94 99.06,27.94 102.23,30.48 Q6.S 107.95,31.75 111.12,33.02 119.38,33.02 | v55.24,18.41 75.56,18.41 77.47,20.32 82.55,20.32 85.09,21.59 | R26.1 80.01,5.71 82.55,7.62 CWID/BEEP.1 | OP1.3 33.02,52.07 31.75,50.8 31.75,47.62 | 31.75,47.62 36.2,47.62 37.47,46.35 37.47,43.81 DTMF-M.1 | 31.75,47.62 31.11,46.99 19.05,46.99 17.78,45.72 D6.A | v55.24,26.04 74.3,26.04 76.83,28.57 83.82,28.57 85.09,27.3 | 85.09,27.3 85.09,25.4 RECORD.1
  Bottom 0.813: 22.86,31.11 15.88,31.11 13.97,33.02 | MAINRADIO.3 9.53,45.72 arc-90 7.62,47.62 7.62,51.44 arc-90 9.53,53.34 21.59,53.34 arc90 22.86,55.24 arc-90 24.77,57.15 39.37,57.15 C6.2
  Bottom 1.27: C4.2 33.02,69.85 D4.A | IC2.9 69.22,54.61 66.67,52.07 60.96,52.07 | C2.1 C1.1 60.96,52.07 | IC2.5 IC2.6 | C16.2 57.15,80.01 | D7.A LINKRADIO.2 arc-161 8.89,20.32 arc31 Q8.1 13.97,23.5 16.51,26.04 C24.1 21.59,26.67 22.86,27.94 22.86,31.11 22.86,31.75 24.13,33.02 D11.A | 60.96,52.07 U$7.J1.6 58.42,44.45 v57.15,44.45 | OP2.3 149.22,43.18 148.59,43.81 MAINRADIO1.5 | U$9.2 137.16,29.21 134.62,26.67 U$6.10 | R26.1 65.41,5.71 63.5,7.62 U$7.J2.4 v55.24,8.89 50.16,8.89 C28.1 | M2.J2.2 v97.79,72.39 | v55.24,33.66 v57.15,33.66 | MAINRADIO.3 D6.A 19.05,43.18 20.32,41.91 20.32,39.37 19.05,38.1 R14.1 16.51,38.1 15.24,36.83 15.24,34.29 13.97,33.02 Q9.3 | REPEAT.1 43.81,32.38 Q1.S 47.62,38.1 45.09,40.64 DTMF-M.1 | DTMF-L.1 46.35,26.04 v55.24,26.04 | POWER.K 175.9,71.12 177.16,69.85 177.16,58.42 | 177.16,58.42 177.16,45.72 | 177.16,45.72 177.16,34.29 175.9,33.02 RX.K 161.29,33.02 160.02,34.29 MAINRADIO2.5 | VALID/DTMF.K 177.16,58.42 | TX.K 177.16,45.72 | 90.17,20.95 89.53,20.95 RECORD.1 85.09,21.59
  Bottom 1.422: C6.2 43.18,58.42 IC1.2 43.18,67.31 44.45,68.58 55.24,68.58 57.15,70.48 C3.-
  Bottom 1.676: U$9.15 119.38,33.02 U$9.16 | U$9.1 U$9.2
  Bottom 1.778: D4.A D3.A
  Bottom 2.184: AC.3 13.89,70.41 16.51,73.03 16.51,73.66 | 16.51,73.66 16.51,76.2 16.51,77.44 12VDC.1 | C4.2 16.51,73.66
  Bottom 2.54: C3.- 57.15,80.01 54.61,82.55 19.05,82.55 16.51,80.01 16.51,76.2
  pour Bottom: 2.54,86.36 153.67,86.36 153.67,0 2.54,0
  pour Bottom: 154.94,86.36 182.88,86.36 182.88,21.59 154.94,21.59
HEADER_BUSY_RX_LED
  Bottom 1.27: MAINRADIO1.4 135.25,59.69 133.99,58.42 R13.1
HEADER_DTMF_LED
  Bottom 0.406: MAINRADIO1.2 138.43,64.77 137.16,66.04 137.16,77.47 134.62,80.01 102.87,80.01 101.6,81.28 85.72,81.28 R5.1
HEADER_TX_LED
  Bottom 1.27: R2.2 MAINRADIO1.3
LINK_MAIN_AUDIO_MIX
  Bottom 0.406: C11.1 52.07,40.64 53.98,38.73 64.14,38.73 68.58,34.29 68.58,31.75 70.48,29.84 73.03,29.84 74.93,31.75 C8.2
  Bottom 1.27: C7.2 R11.2 46.99,45.72 | 46.99,45.72 50.8,45.72 52.07,44.45 C11.1 | R1.2 46.35,52.07 46.99,51.44 46.99,45.72
LINK_SPKR_AUDIO
  Bottom 1.27: LINKRADIO.1 C23.- arc-90 20.32,22.86 21.59,22.86 arc-90 C10.-
MAIN_COS
  Bottom 1.27: D12.C MAINRADIO.1
MAIN_SPEAKER_AUDIO
  Bottom 1.27: C20.+ C21.- MAINRADIO.2
MIC
  Bottom 1.27: MAINRADIO.5 arc-90 12.7,38.1 C18.1
MIC/IN2
  Bottom 0.406: R24.1 114.94,18.41 113.03,16.51 98.42,16.51 97.79,17.14 93.98,17.14 93.34,16.51 83.19,16.51 81.92,17.78 78.11,17.78 76.2,15.88 46.99,15.88 40.64,13.97 35.56,8.89 30.48,8.89 29.21,10.16 24.13,10.16 20.32,13.97 17.78,13.97 LINKRADIO.3
  Bottom 1.27: R24.1 R29.1
MISO
  Bottom 1.27: M2.J1.15 119.38,39.37 121.92,36.83 U$9.13
  Bottom 1.676: U$9.13 U$9.14
MOSI
  Bottom 1.27: M2.J1.14 121.92,41.91 127,36.83 U$9.9
  Bottom 1.676: U$9.9 U$9.10
N$1
  Bottom 0.406: R10.1 137.16,10.79 144.78,18.41 144.78,31.11 OP2.1
N$2
  Bottom 0.813: R4.1 62.23,72.39 62.23,64.77 59.69,62.23 56.52,62.23 54.61,60.33 R1.1
  Bottom 1.27: IC2.2 67.31,72.39 R4.1
N$3
  Bottom 1.27: IC2.3 66.04,69.85 64.77,68.58 R4.2
N$5
  Bottom 0.61: IC2.1 71.12,74.93 72.39,73.66 72.39,69.22 70.48,67.31 IC2.4
N$6
  Bottom 0.61: R6.1 74.3,3.17 74.93,2.54 139.7,2.54 142.24,5.08 142.24,7.62 149.86,15.24 Q4.2
N$9
  Bottom 1.676: C15.2 CWID/BEEP.3
N$10
  Bottom 1.27: C1.2 XTAL.2 IC2.7
N$13
  Bottom 0.61: C18.2 6.35,35.56 arc90 4.45,33.66 4.45,13.34 arc90 6.99,10.79 arc-26 R9.2
N$14
  Bottom 0.406: IC2.17 76.2,72.39 74.93,71.12 74.93,62.23 76.2,60.96 81.28,60.96 R3.2
  Bottom 1.27: R3.2 C5.2
N$16
  Bottom 1.27: IC2.15 85.72,67.31 R8.2
N$17
  Bottom 0.406: R29.2 113.67,10.79 111.76,12.7 103.5,12.7 102.87,12.06 102.87,9.53 101.6,8.26 97.79,8.26 C29.2
N$18
  Bottom 1.27: OP1.1 R7.1
N$22
  Bottom 0.406: C7.1 35.56,43.81 38.1,41.27 DTMF-M.2
N$25
  Bottom 1.676: CWID/BEEP.2 C14.2
N$26
  Bottom 1.27: REPEAT.3 39.37,34.29 R11.1
N$27
  Bottom 0.406: REPEAT.2 38.1,20.95 arc90 41.27,17.78 C9.2
N$29
  Bottom 0.61: RECORD.2 C19.2
N$30
  Bottom 0.61: RECORD.3 76.83,22.86 74.93,20.95 53.34,20.95 52.07,19.68 C17.1
N$31
  Bottom 0.406: C8.1 77.47,26.67 74.3,23.5 60.96,23.5 60.33,22.86 52.7,22.86 50.16,20.32 50.16,18.41 48.9,17.14 45.72,17.14 43.18,16.51 DTMF-L.2
N$34
  Bottom 1.27: C19.1 R23.2
N$38
  Bottom 1.27: R21.1 POWER.A
N$45
  Bottom 0.406: C11.2 53.34,36.83 58.42,36.83 59.69,35.56 R17.1
N$46
  Bottom 1.27: Q9.2 8.26,29.84 7.62,29.21 7.62,24.13 Q8.3
N$47
  Bottom 0.61: C13.2 107.31,19.05
  Bottom 1.27: 107.31,19.05 TALK.2
N$48
  Bottom 1.27: D11.C D10.A 20.95,35.56 22.86,37.47 22.86,43.18 20.95,45.09 C21.+
N$50
  Bottom 1.27: C24.2 26.67,26.04 27.94,27.3 R27.2 29.21,29.21 30.48,30.48 30.48,35.56 | R14.2 29.21,38.1 30.48,36.83 30.48,35.56 | D10.C 30.48,35.56
N$51
  Bottom 1.27: R27.1 13.97,29.21 12.7,27.94 12.7,26.67 12.06,26.04 Q8.2
N$52
  Bottom 0.406: R12.2 133.35,69.85 128.91,65.41 128.91,52.07 132.72,48.26 135.25,48.26 143.51,40.01 143.51,19.05 137.16,12.7 125.73,12.7 124.46,11.43 U$6.3
N$53
  Bottom 0.406: R15.2 131.44,74.93 127.64,71.12 127.64,51.44 132.08,46.99 134.62,46.99 142.24,39.37 142.24,19.68 136.53,13.97 123.83,13.97 121.92,12.06 U$6.2
N$54
  Bottom 0.61: R18.1 48.26,10.79 C17.2
N$55
  Bottom 1.27: D13.C 9.53,55.24 arc90 5.71,51.44 5.71,40.64 arc90 8.26,38.1 arc-152 8.89,33.02 arc34 Q9.1
N$58
  Bottom 0.406: U$6.8 137.16,5.08 135.89,3.81 117.47,3.81 113.67,7.62 110.49,7.62 PLAYER.3
N$60
  Bottom 0.406: U$6.6 132.08,6.35 130.81,5.08 118.11,5.08 114.3,8.89 PLAYER.1
N$70
  Bottom 1.27: Q5.2 Q4.3
N$72
  Bottom 1.27: Q6.D R24.2
N$73
  Bottom 0.406: Q1.G R30.2
N$77
  Bottom 1.27: D5.A D7.C 22.86,15.88 20.95,17.78 C23.+
N$78
  Bottom 0.61: D5.C 18.41,12.06 arc-90 20.32,10.16 20.32,5.08 22.23,3.17 51.44,3.17 52.07,3.81 C28.2 R26.2
  Bottom 1.27: R26.2 R6.2
NA
  Bottom 0.406: Q1.D 43.18,27.94 arc-78 39.37,28.57 arc106 36.83,28.57 arc-53 35.56,27.94 arc-90 33.02,29.84 33.02,37.47 arc90 30.48,40.64 R28.1
  Bottom 1.27: D6.C R28.1
PTT
  Bottom 0.406: R31.2 106.05,35.56 Q6.G
PTT_LINK
  Bottom 1.27: D8.A M2.J1.10 R31.1
PTT_MAIN
  Bottom 0.406: D9.A M2.J1.7 106.05,59.69 101.6,55.24 101.6,35.56 97.16,31.11 94.61,31.11 92.71,33.02 85.09,33.02 83.82,34.29 74.93,34.29 R30.1
Q1
  Bottom 0.61: IC2.11 78.74,57.15 81.28,55.88 82.55,55.88 83.82,54.61 83.82,52.07 88.9,46.99 M2.J2.12
Q2
  Bottom 0.61: IC2.12 78.74,59.69 81.92,57.78 83.82,57.78 85.72,55.88 85.72,52.7 88.9,49.53 M2.J2.11
Q3
  Bottom 0.61: IC2.13 86.36,62.23 87.63,60.96 87.63,54.61 90.17,52.07 M2.J2.10
Q4
  Bottom 0.61: IC2.14 86.36,64.77 88.9,62.23 88.9,55.88 90.17,54.61 M2.J2.9
RECORD_AUDIO
  Bottom 0.406: R23.1 99.06,37.47 99.06,60.96 97.79,62.23 M2.J2.6
RX
  Bottom 1.27: M2.J1.1 R15.1
RX_BUSY
  Bottom 1.27: R13.2 M2.J1.9
SCAN_CTSS_INT1
  Bottom 0.406: R17.2 84.45,35.56 85.72,34.29 93.34,34.29 95.25,32.38 96.52,32.38 100.33,36.2 100.33,57.15 105.41,62.23 M2.J1.6 116.2,62.23 118.75,59.69 124.46,59.69 125.73,60.96 125.73,63.5 124.46,64.77 C12.1
SCAN_DTMF_INT0
  Bottom 0.813: R8.1 100.33,78.74 102.87,76.2 102.87,66.04 104.14,64.77 M2.J1.5
SCK  (via drill 0.9 pad 1.78)
  Top 1.27: v90.81,39.37 v90.81,27.3
  Bottom 0.406: U$9.11 124.46,30.48 123.19,29.21 118.11,29.21 116.2,27.3 107.95,27.3 107.31,27.94 101.6,27.94 99.69,26.04 92.08,26.04 v90.81,27.3
  Bottom 1.27: M2.J2.15 v90.81,39.37
  Bottom 1.676: U$9.11 U$9.12
SCL
  Bottom 0.406: M2.J2.7 96.52,59.69 97.79,58.42 97.79,38.1 95.25,35.56 86.36,35.56 IC2NLCD.4 77.47,38.1 74.93,40.64 69.85,40.64 68.58,41.91 U$7.J1.3
SDA
  Bottom 0.406: M2.J2.8 95.89,57.15 96.52,56.52 96.52,38.73 94.93,37.15 94.61,36.83 87.63,36.83 86.36,38.1 86.36,39.37 85.09,40.64 IC2NLCD.3 77.47,40.64 76.2,41.91 76.2,44.45 74.93,45.72 67.31,45.72 66.04,44.45 U$7.J1.4
TALK_TIME_AUDIO_OUT
  Bottom 0.406: M2.J1.12 124.46,46.99 132.08,39.37 132.08,38.1 133.35,36.83 137.79,36.83 139.7,34.92 139.7,20.95 138.43,19.68 123.19,19.68 116.2,22.86 113.67,22.86 113.03,22.23 113.03,20.95 111.76,19.68 109.86,19.68 106.05,22.23 TALK.3
TX
  Bottom 1.27: M2.J1.2 R12.1
TX_LED
  Bottom 1.27: MAINRADIO2.3 166.37,55.88 168.91,53.34 168.91,49.53 170.18,48.26 TX.A
TX_PTT
  Bottom 0.406: D9.C 118.11,69.85 119.38,68.58 D8.C R2.1
VALID_DTMF_TONE
  Bottom 1.27: IC2.16 R3.1 R5.2
VCC_5V  (1 unrouted)
  Bottom 0.61: C16.1 80.01,83.82 139.7,83.82 142.24,81.28 142.24,78.74 148.59,72.39 MAINRADIO1.1
  Bottom 1.27: IC1.3 53.98,63.5 56.52,66.04 58.42,66.04 60.33,67.94 60.33,75.56 62.23,77.47 76.2,77.47 | 76.2,77.47 80.01,77.47 82.55,74.93 M2.J2.1 | C16.1 76.2,77.47 | MAINRADIO2.1 R21.2
  Bottom 1.422: C6.1 IC1.3